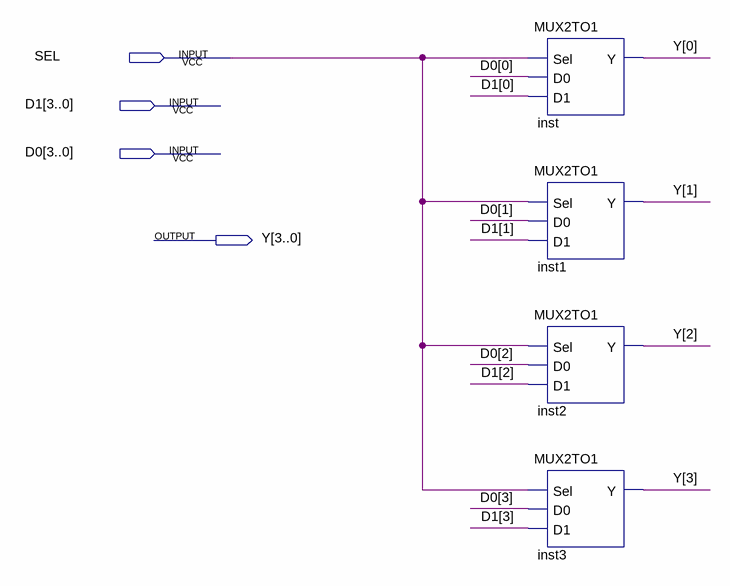
[diagram p0: schematic sheet]
// Quartus schematic MUX2TO1_4BIT.bdf as structural Verilog: 4 symbols, 4 pins
module MUX2TO1_4BIT (
  input  SEL,
  input  [3:0] D1,
  input  [3:0] D0,
  output [3:0] Y
);

  MUX2TO1 inst (.Sel(SEL), .D0(D0[0]), .D1(D1[0]), .Y(Y[0]));
  MUX2TO1 inst1 (.Sel(SEL), .D0(D0[1]), .D1(D1[1]), .Y(Y[1]));
  MUX2TO1 inst2 (.Sel(SEL), .D0(D0[2]), .D1(D1[2]), .Y(Y[2]));
  MUX2TO1 inst3 (.Sel(SEL), .D0(D0[3]), .D1(D1[3]), .Y(Y[3]));
endmodule
